# EAGLE design MK II (EAGLE 6.2)

## Sheet 1 of 3: Power Supply Regulated: +15, -15, +5
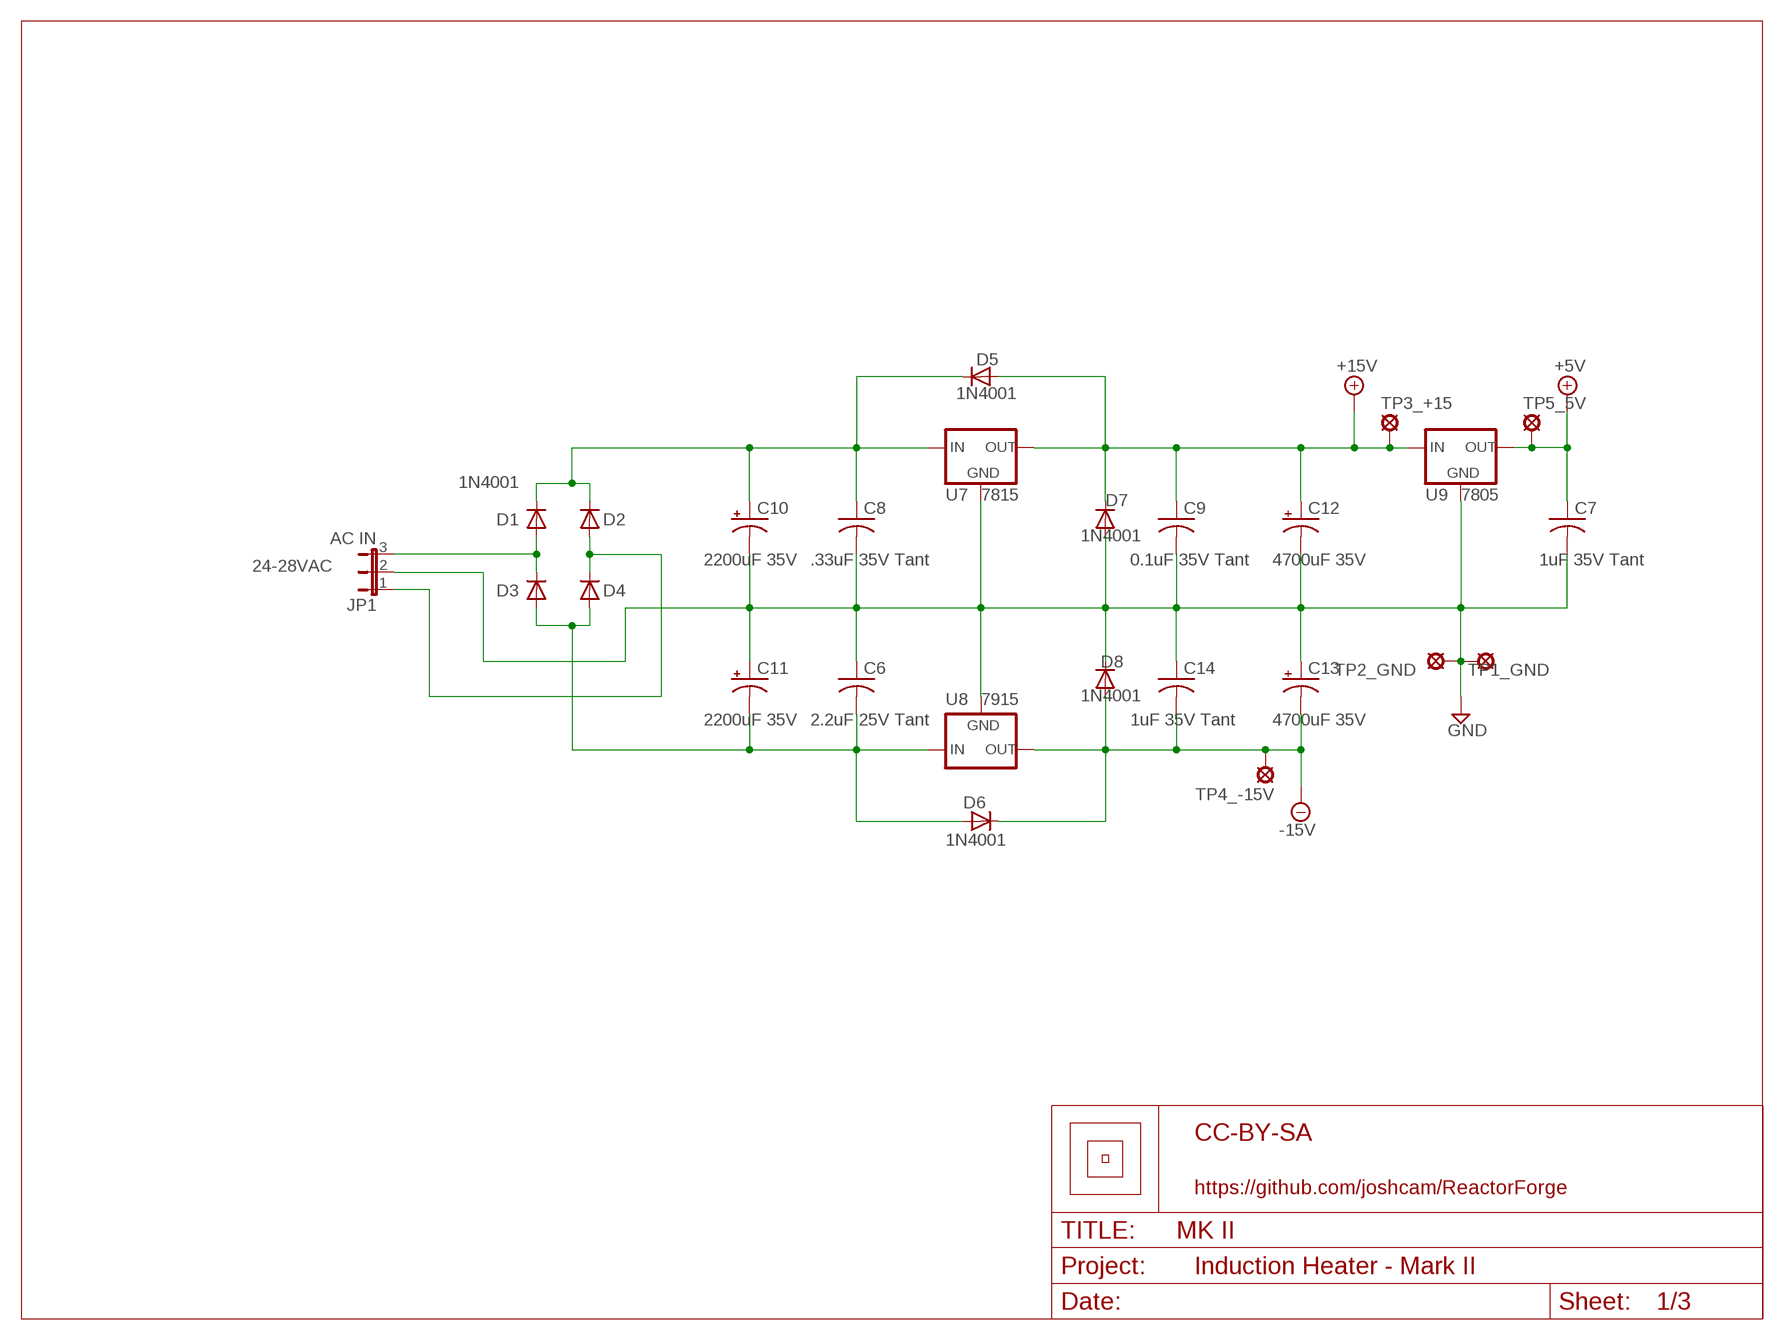
[diagram p0: schematic, sheet 1]
U$2 (LETTER_L): LICENSE: CC-BY-SA; PROJECT: Induction Heater - Mark II; URL: https://github.com/joshcam/ReactorForge

### Parts
C6  2.2uF 25V Tant  C-USC1206  [C1206]
C7  1uF 35V Tant  C-USC1206  [C1206]
C8  .33uF 35V Tant  C-USC1206  [C1206]
C9  0.1uF 35V Tant  C-USC1206  [C1206]
C10  2200uF 35V  CPOL-USE7.5-18  [E7,5-18]
C11  2200uF 35V  CPOL-USE7.5-18  [E7,5-18]
C12  4700uF 35V  CPOL-USE7.5-18  [E7,5-18]
C13  4700uF 35V  CPOL-USE7.5-18  [E7,5-18]
C14  1uF 35V Tant  C-USC1206  [C1206]
D1  1N4001  [DIODE.4-AXIAL]
D2  1N4001  [DIODE.4-AXIAL]
D3  1N4001  [DIODE.4-AXIAL]
D4  1N4001  [DIODE.4-AXIAL]
D5  1N4001  [DIODE.4-AXIAL]
D6  1N4001  [DIODE.4-AXIAL]
D7  1N4001  [DIODE.4-AXIAL]
D8  1N4001  [DIODE.4-AXIAL]
JP1  AC IN  JP2E  [JP2]
TP1_GND  SE14  [SE14]
TP2_GND  SE14  [SE14]
TP3_+15  SE14  [SE14]
TP4_-15V  SE14  [SE14]
TP5_5V  SE14  [SE14]
U7  7815  78XXS  [78XXS]
U8  7915  79XXS  [79XXS]
U9  7805  78XXS  [78XXS]

### Nets
+5V: C7.1 TP5_5V.MP U9.OUT ; also sheet 2
+15V: C9.1 C12.+ D5.A D7.C TP3_+15.MP U7.OUT U9.IN ; also sheet 2,3
-15V: C13.- C14.2 D6.C D8.A TP4_-15V.MP U8.OUT ; also sheet 2
GND: C6.1 C7.2 C8.2 C9.2 C10.- C11.+ C12.- C13.+ C14.1 D7.A D8.C JP1.2 TP1_GND.MP TP2_GND.MP U7.GND U8.GND U9.GND ; also sheet 2,3
N$10: C8.1 C10.+ D1.C D2.C D5.C U7.IN
N$12: D2.A D4.C JP1.1
N$16: D1.A D3.C JP1.3
N$17: C6.2 C11.- D3.A D4.A D6.A U8.IN

### Notes on the sheet
- 24-28VAC

## Sheet 2 of 3: Logic Control PLL/uController Resonant Lock Current Limiting System Monitoring
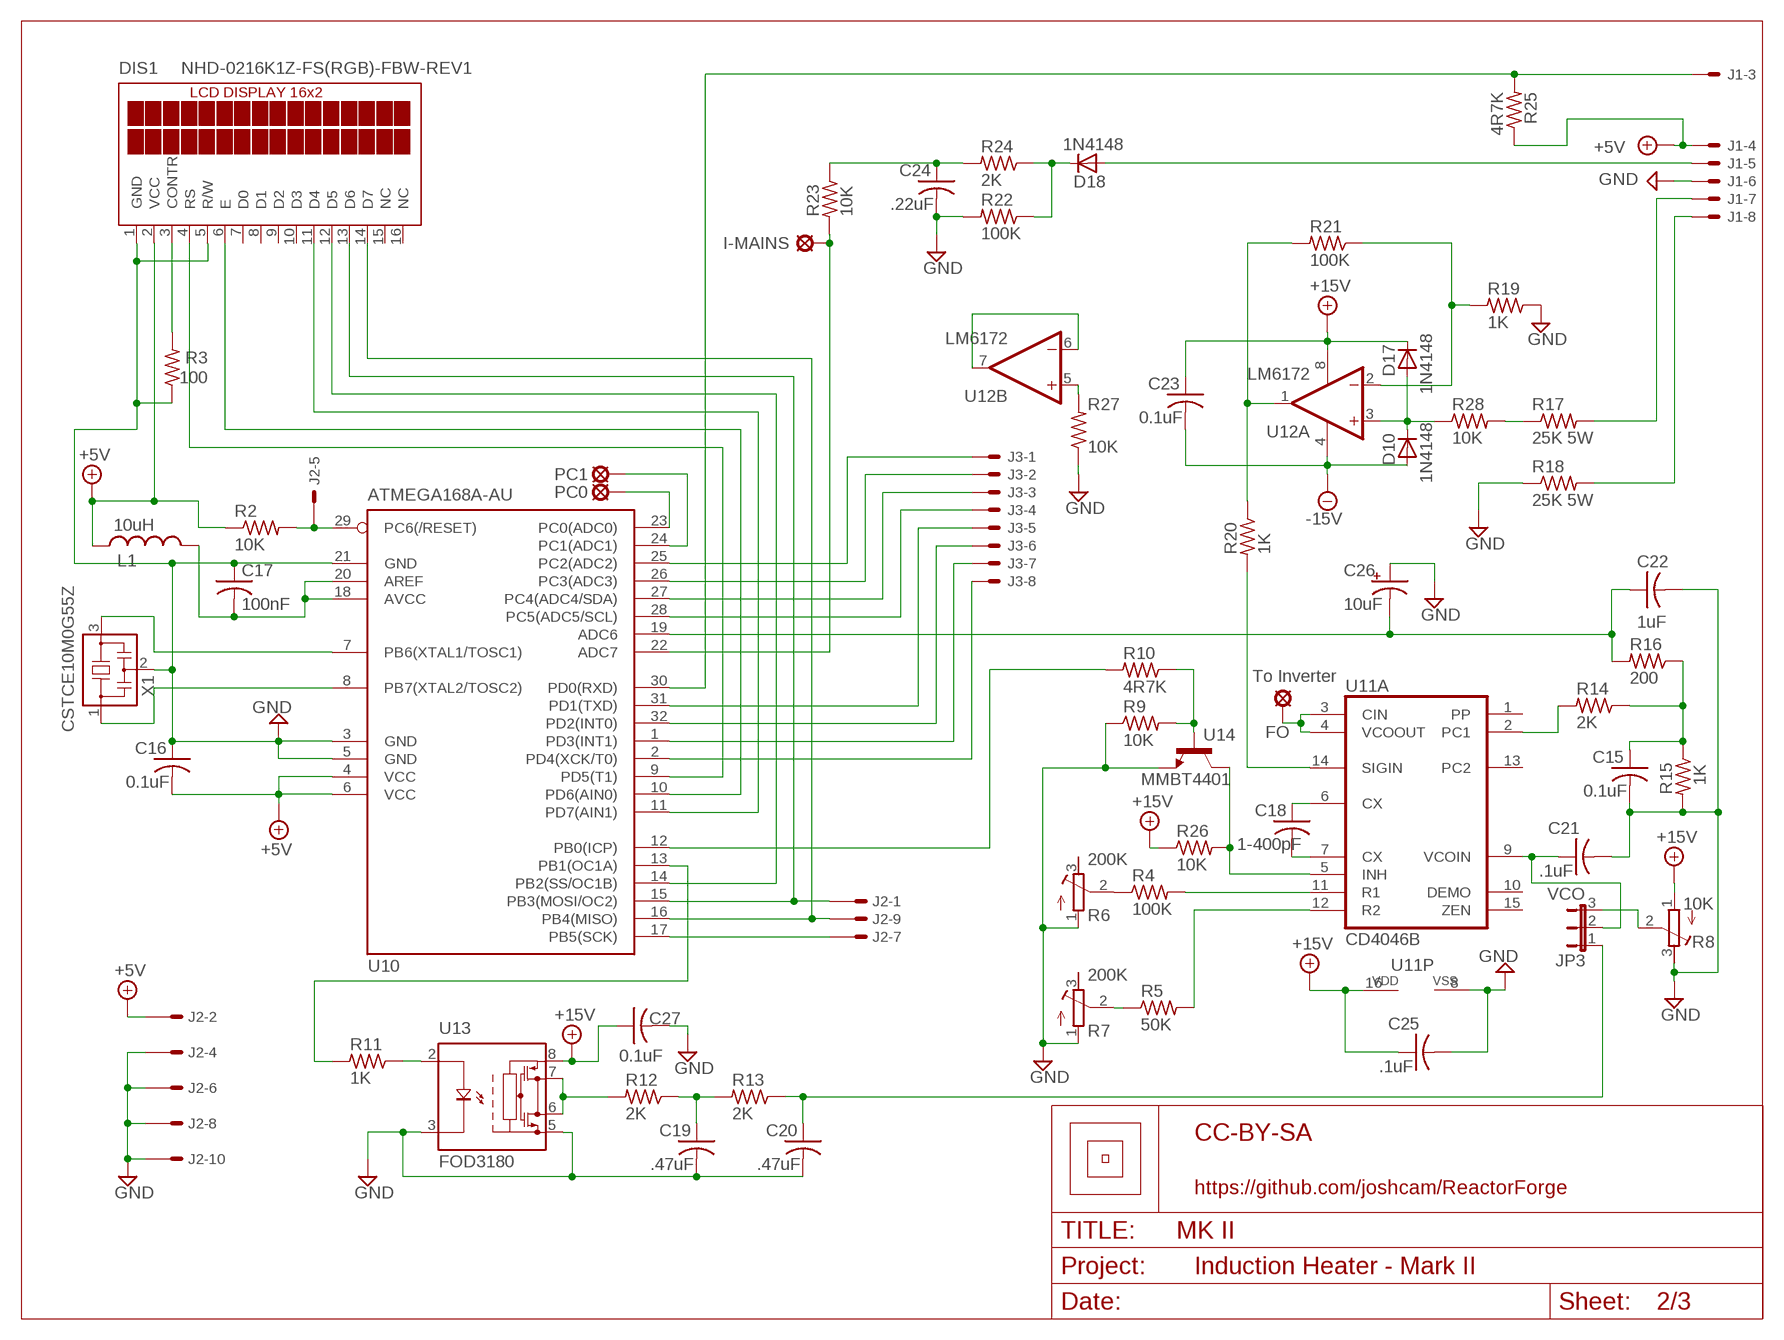
[diagram p1: schematic, sheet 2]
U$3 (LETTER_L): LICENSE: CC-BY-SA; PROJECT: Induction Heater - Mark II; URL: https://github.com/joshcam/ReactorForge

### Parts
C15  0.1uF  C-USC1206  [C1206]
C16  0.1uF  C-USC1206  [C1206]
C17  100nF  C-USC1206  [C1206]
C18  1-400pF  C-USC1206  [C1206]
C19  .47uF  C-USC1206  [C1206]
C20  .47uF  C-USC1206  [C1206]
C21  .1uF  C-USC1206  [C1206]
C22  1uF  C-USC1206  [C1206]
C23  0.1uF  C-USC1206  [C1206]
C24  .22uF  C-USC1206  [C1206]
C25  .1uF  C-USC1206  [C1206]
C26  10uF  CPOL-USE2.5-7  [E2,5-7]
C27  0.1uF  C-USC1206  [C1206]
D10  1N4148  [SOD-123]
D17  1N4148  [SOD-123]
D18  1N4148  [SOD-123]
DIS1  NHD-0216K1Z-FS(RGB)-FBW-REV1  TUXGR_16X2_R2  [TUXGR_16X2_R2]
FO  SE14  [SE14]
I-MAINS  SE14  [SE14]
J1  22-23-2081  [22-23-2081]
J2  057-010-1  [057-010-1]
J3  22-23-2081  [22-23-2081]
JP3  VCO  JP2E  [JP2]
L1  10uH  L-USL2012C  [L2012C]
PC0  SE14  [SE14]
PC1  SE14  [SE14]
R2  10K  R-US_M1206  [M1206]
R3  100  R-US_M1206  [M1206]
R4  100K  R-US_M1206  [M1206]
R5  50K  R-US_M1206  [M1206]
R6  200K  R-TRIMM4G/J  [RTRIM4G/J]
R7  200K  R-TRIMM4G/J  [RTRIM4G/J]
R8  10K  R-TRIMM4G/J  [RTRIM4G/J]
R9  10K  R-US_M1206  [M1206]
R10  4R7K  R-US_M1206  [M1206]
R11  1K  R-US_M1206  [M1206]
R12  2K  R-US_M1206  [M1206]
R13  2K  R-US_M1206  [M1206]
R14  2K  R-US_M1206  [M1206]
R15  1K  R-US_M1206  [M1206]
R16  200  R-US_M1206  [M1206]
R17  25K 5W  R-US_0617/22  [0617/22]
R18  25K 5W  R-US_0617/22  [0617/22]
R19  1K  R-US_M1206  [M1206]
R20  1K  R-US_M1206  [M1206]
R21  100K  R-US_M1206  [M1206]
R22  100K  R-US_M1206  [M1206]
R23  10K  R-US_M1206  [M1206]
R24  2K  R-US_M1206  [M1206]
R25  4R7K  R-US_M1206  [M1206]
R26  10K  R-US_M1206  [M1206]
R27  10K  R-US_M1206  [M1206]
R28  10K  R-US_M1206  [M1206]
U10  ATMEGA168A-AU  MEGA8-AI  [TQFP32-08]
U11  CD4046B  4046D  [SO16]
U12  LM6172  LM358D  [SO08]
U13  FOD3180  [SO08]
U14  MMBT4401  [SOT23]
X1  CSTCE10M0G55Z  [3-SMD]

### Nets
1WIRE: J1.3 R25.2 U10.30(PD0(RXD))
+5V: C16.2 DIS1.2(VCC) J1.4 J2.2 L1.1 R2.1 R25.1 U10.4(VCC) U10.6(VCC) ; also sheet 1
+15V: C23.1 C25.1 C27.1 D17.C R8.1(E) R26.1 U11.16(P:VDD) U12.8(P:V+) U13.8 ; also sheet 1,3
-15V: C23.2 D10.A U12.4(P:V-) ; also sheet 1
AVCC: C17.2 L1.2 U10.18(AVCC) U10.20(AREF)
FO: FO.MP U11.3(A:CIN) U11.4(A:VCOOUT) ; also sheet 3
GND: C15.2 C16.1 C17.1 C19.2 C20.2 C21.2 C22.2 C24.2 C25.2 C26.+ C27.2 DIS1.1(GND) DIS1.5(R/W) J1.6 J2.4 J2.6 J2.8 J2.10 R3.1 R6.1(E) R7.1(E) R8.3(A) R9.1 R15.2 R18.1 R19.1 R22.2 R27.1 U10.3(GND) U10.5(GND) U10.21(GND) U11.8(P:VSS) U13.3 U13.5 U14.2(E) X1.2 ; also sheet 1,3
GND1: C22.1 C26.- R16.2 U10.19(ADC6)
N$6: D10.C D17.A R28.1 U12.3(A:+IN)
N$8: U12.6(B:-IN) U12.7(B:OUT)
N$18: D18.A J1.5
N$19: U10.8(PB7(XTAL2/TOSC2)) X1.1
N$20: U10.7(PB6(XTAL1/TOSC1)) X1.3
N$21: J2.5 R2.2 U10.29(PC6(/RESET))
N$22: DIS1.3(CONTR) R3.2
N$23: R11.1 U13.2
N$24: DIS1.4(RS) U10.9(PD5(T1))
N$25: DIS1.6(E) U10.10(PD6(AIN0))
N$26: DIS1.11(D4) U10.11(PD7(AIN1))
N$27: DIS1.12(D5) U10.14(PB2(SS/OC1B))
N$28: DIS1.13(D6) J2.1 U10.15(PB3(MOSI/OC2))
N$29: DIS1.14(D7) J2.9 U10.16(PB4(MISO))
N$30: C18.1 U11.6(A:CX)
N$31: C18.2 U11.7(A:CX)
N$32: R4.1 R6.2(S)
N$33: R5.1 R7.2(S)
N$34: R4.2 U11.11(A:R1)
N$35: R5.2 U11.12(A:R2)
N$36: JP3.3 R8.2(S)
N$37: R19.2 R21.1 U12.2(A:-IN)
N$38: R26.2 U11.5(A:INH) U14.3(C)
N$39: R10.2 U10.12(PB0(ICP))
N$40: R11.2 U10.13(PB1(OC1A))
N$41: R9.2 R10.1 U14.1(B)
N$42: R14.2 U11.2(A:PC1)
N$43: R12.2 U13.6 U13.7
N$44: C15.1 R14.1 R15.1 R16.1
N$45: C19.1 R12.1 R13.2
N$46: C20.1 JP3.1 R13.1
N$47: C21.1 JP3.2 U11.9(A:VCOIN)
N$48: R27.2 U12.5(B:+IN)
N$49: R20.1 R21.2 U12.1(A:OUT)
N$50: R20.2 U11.14(A:SIGIN)
N$51: R17.1 R28.2
N$52: J1.8 R18.2
N$53: C24.1 R23.1 R24.2
N$54: D18.C R22.1 R24.1
N$55: I-MAINS.MP R23.2 U10.22(ADC7)
N$56: J1.7 R17.2
N$59: J2.7 U10.17(PB5(SCK))
N$60: J3.8 U10.2(PD4(XCK/T0))
N$61: J3.7 U10.1(PD3(INT1))
N$62: J3.6 U10.32(PD2(INT0))
N$63: J3.5 U10.31(PD1(TXD))
N$64: J3.4 U10.28(PC5(ADC5/SCL))
N$65: J3.3 U10.27(PC4(ADC4/SDA))
N$66: J3.2 U10.26(PC3(ADC3))
N$67: J3.1 U10.25(PC2(ADC2))
N$68: PC0.MP U10.23(PC0(ADC0))
N$69: PC1.MP U10.24(PC1(ADC1))
Unconnected: DIS1.7(D0) DIS1.8(D1) DIS1.9(D2) DIS1.10(D3) DIS1.15(NC) DIS1.16(NC) J2.3 R6.3(A) R7.3(A) U11.1(A:PP) U11.10(A:DEMO) U11.13(A:PC2) U11.15(A:ZEN)

### Notes on the sheet
- To Inverter

## Sheet 3 of 3: Inverter Driver 20W IGBT/MOSFET Driver +-15V Frequency Range: 50-500KHz
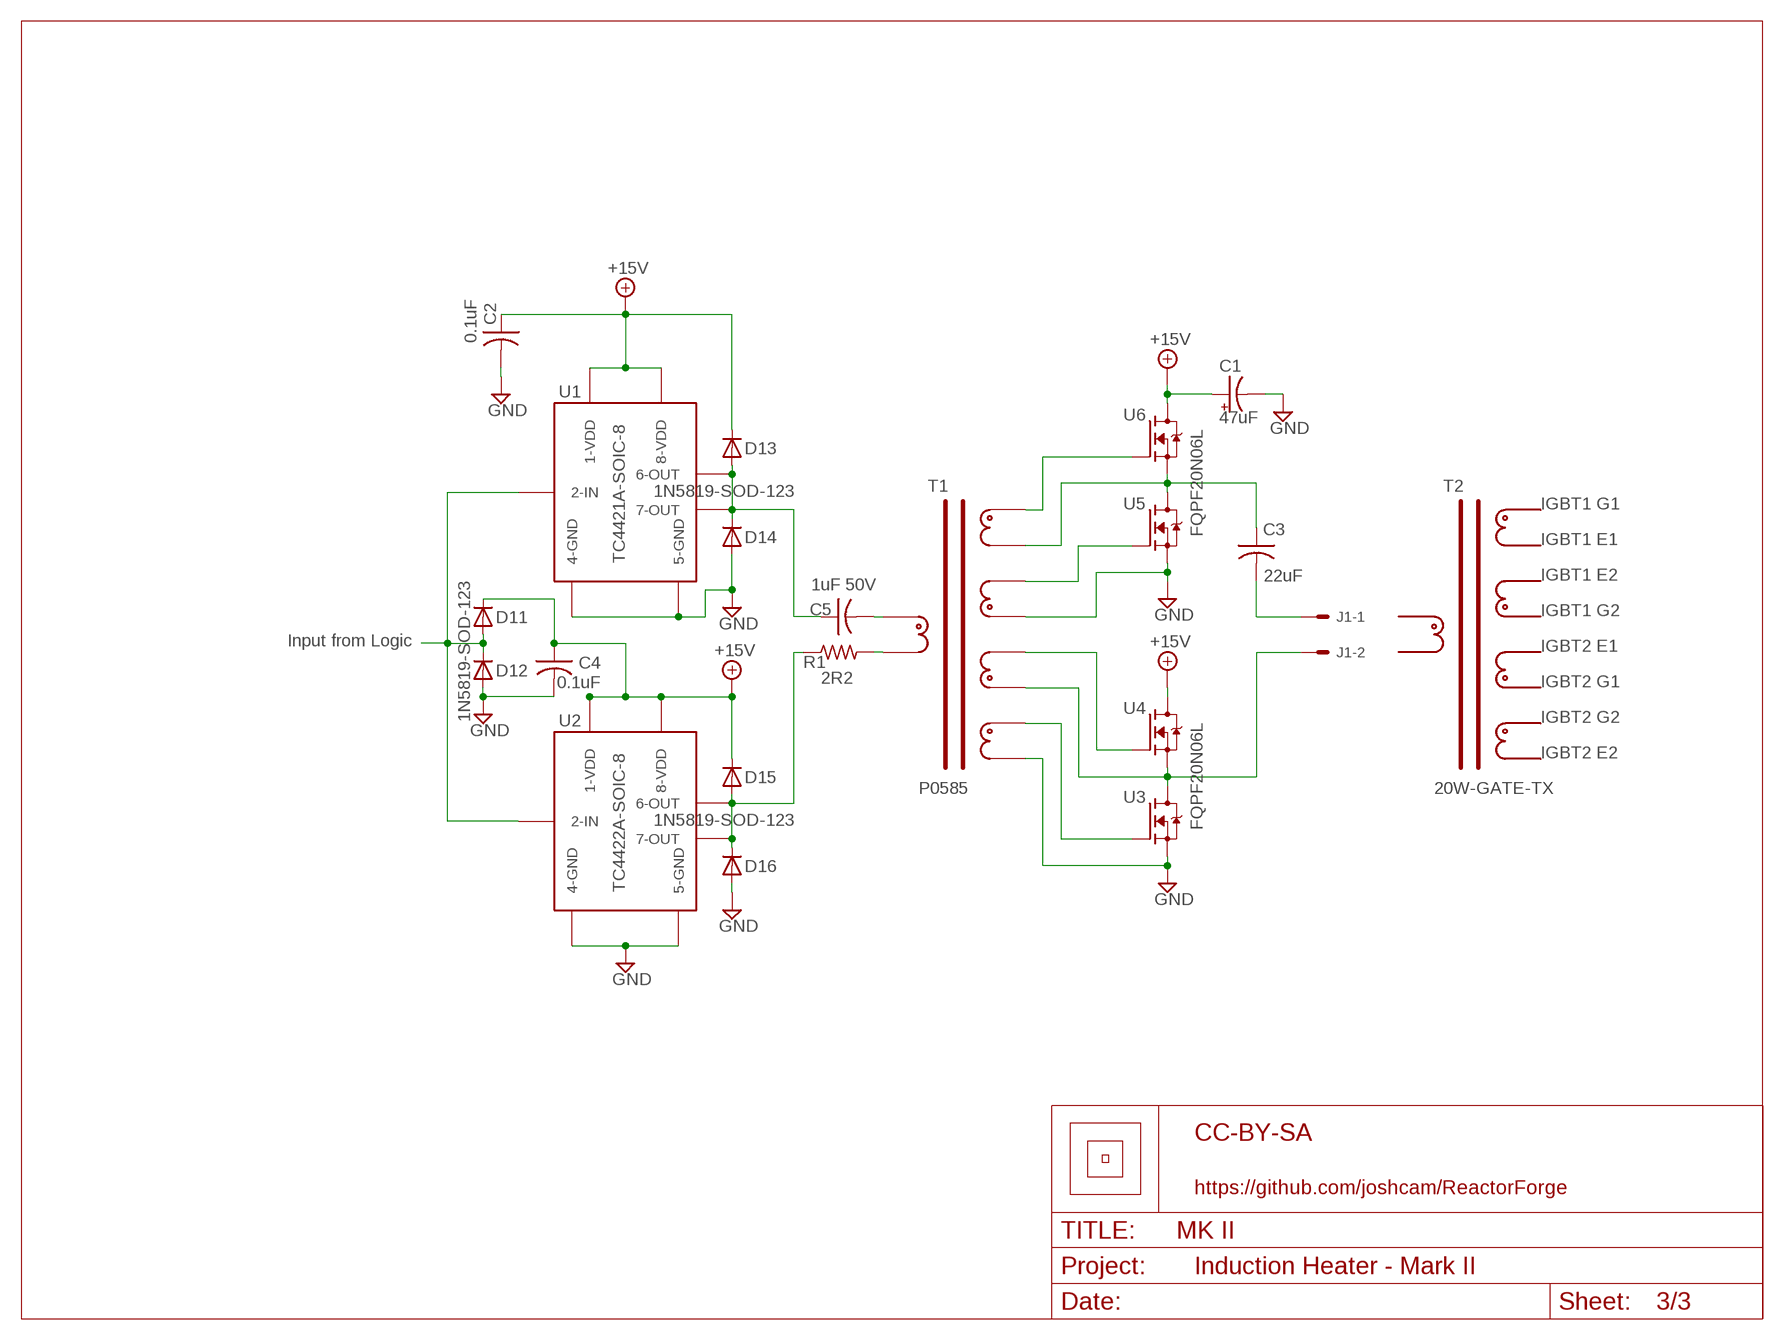
[diagram p2: schematic, sheet 3]
U$1 (LETTER_L): LICENSE: CC-BY-SA; PROJECT: Induction Heater - Mark II; URL: https://github.com/joshcam/ReactorForge

### Parts
C1  47uF  CPOL-USE2.5-7  [E2,5-7]
C2  0.1uF  C-USC1206  [C1206]
C3  22uF  C-USC1206  [C1206]
C4  0.1uF  C-USC1206  [C1206]
C5  1uF 50V  C-USC1206  [C1206]
D11  1N5819-SOD-123  [SOD-123]
D12  1N5819-SOD-123  [SOD-123]
D13  1N5819-SOD-123  [SOD-123]
D14  1N5819-SOD-123  [SOD-123]
D15  1N5819-SOD-123  [SOD-123]
D16  1N5819-SOD-123  [SOD-123]
R1  2R2  R-US_0207/10  [0207/10]
T1  P0585  [P0585]
U1  TC4421A-SOIC-8  [SOIC-8]
U2  TC4422A-SOIC-8  [SOIC-8]
U3  FQPF20N06L  [TO-220-V]
U4  FQPF20N06L  [TO-220-V]
U5  FQPF20N06L  [TO-220-V]
U6  FQPF20N06L  [TO-220-V]

### Nets
+15V: C1.+ C2.1 C4.1 D11.C D13.C D15.C U1.P$1(1-VDD) U1.P$8(8-VDD) U2.P$1(1-VDD) U2.P$8(8-VDD) U4.2(D) U6.2(D) ; also sheet 1,2
FO: D11.A D12.C U1.P$2(2-IN) U2.P$2(2-IN) ; also sheet 2
GND: C1.- C2.2 C4.2 D12.A D14.A D16.A T1.P$4 T1.P$6 U1.P$4(4-GND) U1.P$5(5-GND) U2.P$4(4-GND) U2.P$5(5-GND) U3.3(S) U5.3(S) ; also sheet 1,2
N$1: J1.2 T1.P$9 U3.2(D) U4.3(S)
N$2: C5.1 D13.A D14.C U1.P$6(6-OUT) U1.P$7(7-OUT)
N$3: C5.2 T1.P$1
N$4: R1.2 T1.P$10
N$5: D15.A D16.C R1.1 U2.P$6(6-OUT) U2.P$7(7-OUT)
N$7: C3.1 T1.P$3 U5.2(D) U6.3(S)
N$9: T1.P$2 U6.1(G)
N$11: T1.P$5 U5.1(G)
N$13: T1.P$8 U4.1(G)
N$14: T1.P$7 U3.1(G)
N$15: C3.2 J1.1

### Notes on the sheet
- IGBT1 G1
- IGBT1 E1
- IGBT1 E2
- IGBT1 G2
- Input from Logic
- IGBT2 E1
- IGBT2 G1
- IGBT2 G2
- IGBT2 E2

## Library data of the parts
C1 C10-C13 C26 = resistor:CPOL-US: POLARIZED CAPACITOR, American symbol
C2-C9 C14-C25 C27 = resistor:C-US: CAPACITOR, American symbol
D1-D8 = 1-Custom:1N4001: 1N4001 General Purpose Rectifier Diode
D10 D17 D18 = 1-Custom:1N4148: 1N4148
D11-D16 = 1-Custom:1N5819: 1N5819 Schottky Diode - 40V 1A
DIS1 = display-lcd:TUXGR_16X2_R2: Tuxgraphics LCD display 16x2 characters reflective, without background light Source: tuxgr_12x2_r2.pdf; OC_FARNELL: unknown; OC_NEWARK: unknown
FO I-MAINS PC0 PC1 TP1_GND TP2_GND TP3_+15 TP4_-15V TP5_5V = solpad:SE14: SOLDER PAD E1553, drill 1,4mm, distributor Buerklin, 07F820
J1 J3 = con-molex:22-23-2081: .100" (2.54mm) Center Header - 8 Pin; MF: MOLEX; MPN: 22-23-2081; OC_FARNELL: 1756826; OC_NEWARK: 01C7592
J2 = con-panduit:057-010-: CONNECTOR 10-pin series 057 contact pc board low profile headers; OC_FARNELL: unknown; OC_NEWARK: unknown
JP1 JP3 = jumper:JP2E: JUMPER
L1 = resistor:L-US: INDUCTOR, American symbol
R1 = rcl:R-US_: RESISTOR, American symbol
R2-R5 R9-R28 = resistor:R-US_: RESISTOR, American symbol
R6-R8 = resistor:R-TRIMM: Trimm resistor
T1 = 1-Custom:P0585: P0585NL 1:1:1:1 Offline Gate Drive Transformer 50-500KHz
U1 = 1-Custom:TC4421A: TC4421A 9A High-Speed MOSFET Driver
U2 = 1-Custom:TC4422A: TC4422A 9A High-Speed MOSFET Driver - Non-Inverting
U3-U6 = 1-Custom:FQPF20N06L: FQPF20N06L 60V LOGIC N-Channel MOSFET 30W Max
U7 U9 = v-reg:78XXS: VOLTAGE REGULATOR
U8 = v-reg:79XXS: VOLTAGE REGULATOR
U10 = atmel:MEGA8: MICROCONTROLLER 8 Kbytes FLASH, 1 kbytes SRAM, 512 bytes EEPROM, USART, 6-channel 10 bit ADC, 2-channel 8 bit ADC Pin compatible with Atmega48, ATMega88, ATMega168 Source: avr.lbr; MPN: ATMEGA8-16AU; OC_FARNELL: 9171371; OC_NEWARK: 73M8863
U11 = 40xx:4046: Micropower PLL
U12 = linear:LM358: OP AMP also LM158; LM258; LM2904 Source: http://cache.national.com/ds/LM/LM158.pdf
U13 = 1-Custom:FOD3180: FOD3180 2A High Speed Optocoupler
U14 = 1-Custom:MMBT4401: MMBT4401 40V NPN Small Signal Transistor
X1 = 1-Custom:CSTCE10M0G55Z: CSTCE10M0G55Z-R0 10MHz Ceramic Resonator Industrial Rated

## Net classes
1 supply: width 1.27 mm

## Board
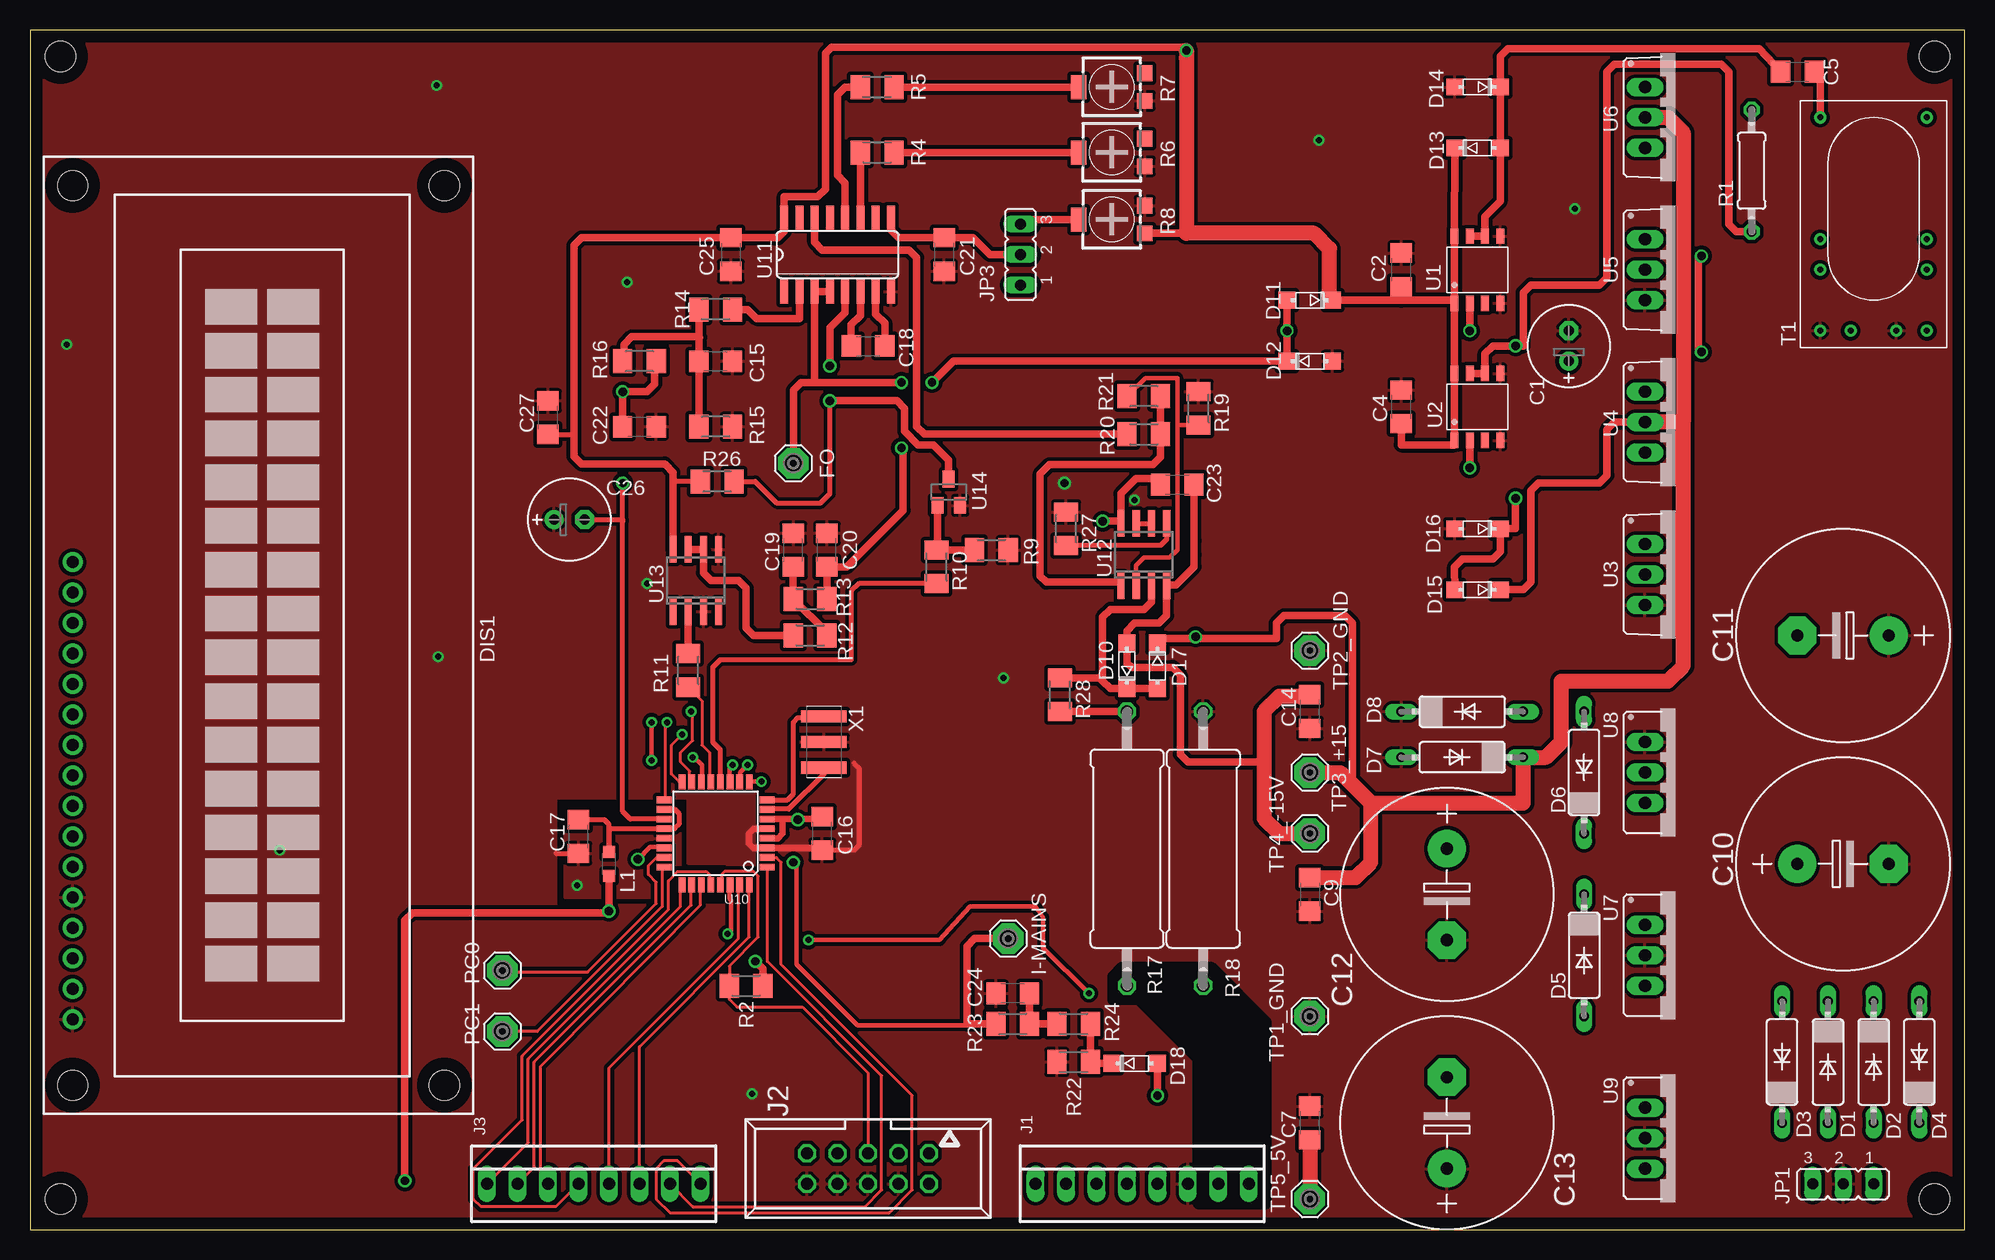
[diagram p3: board, top side]
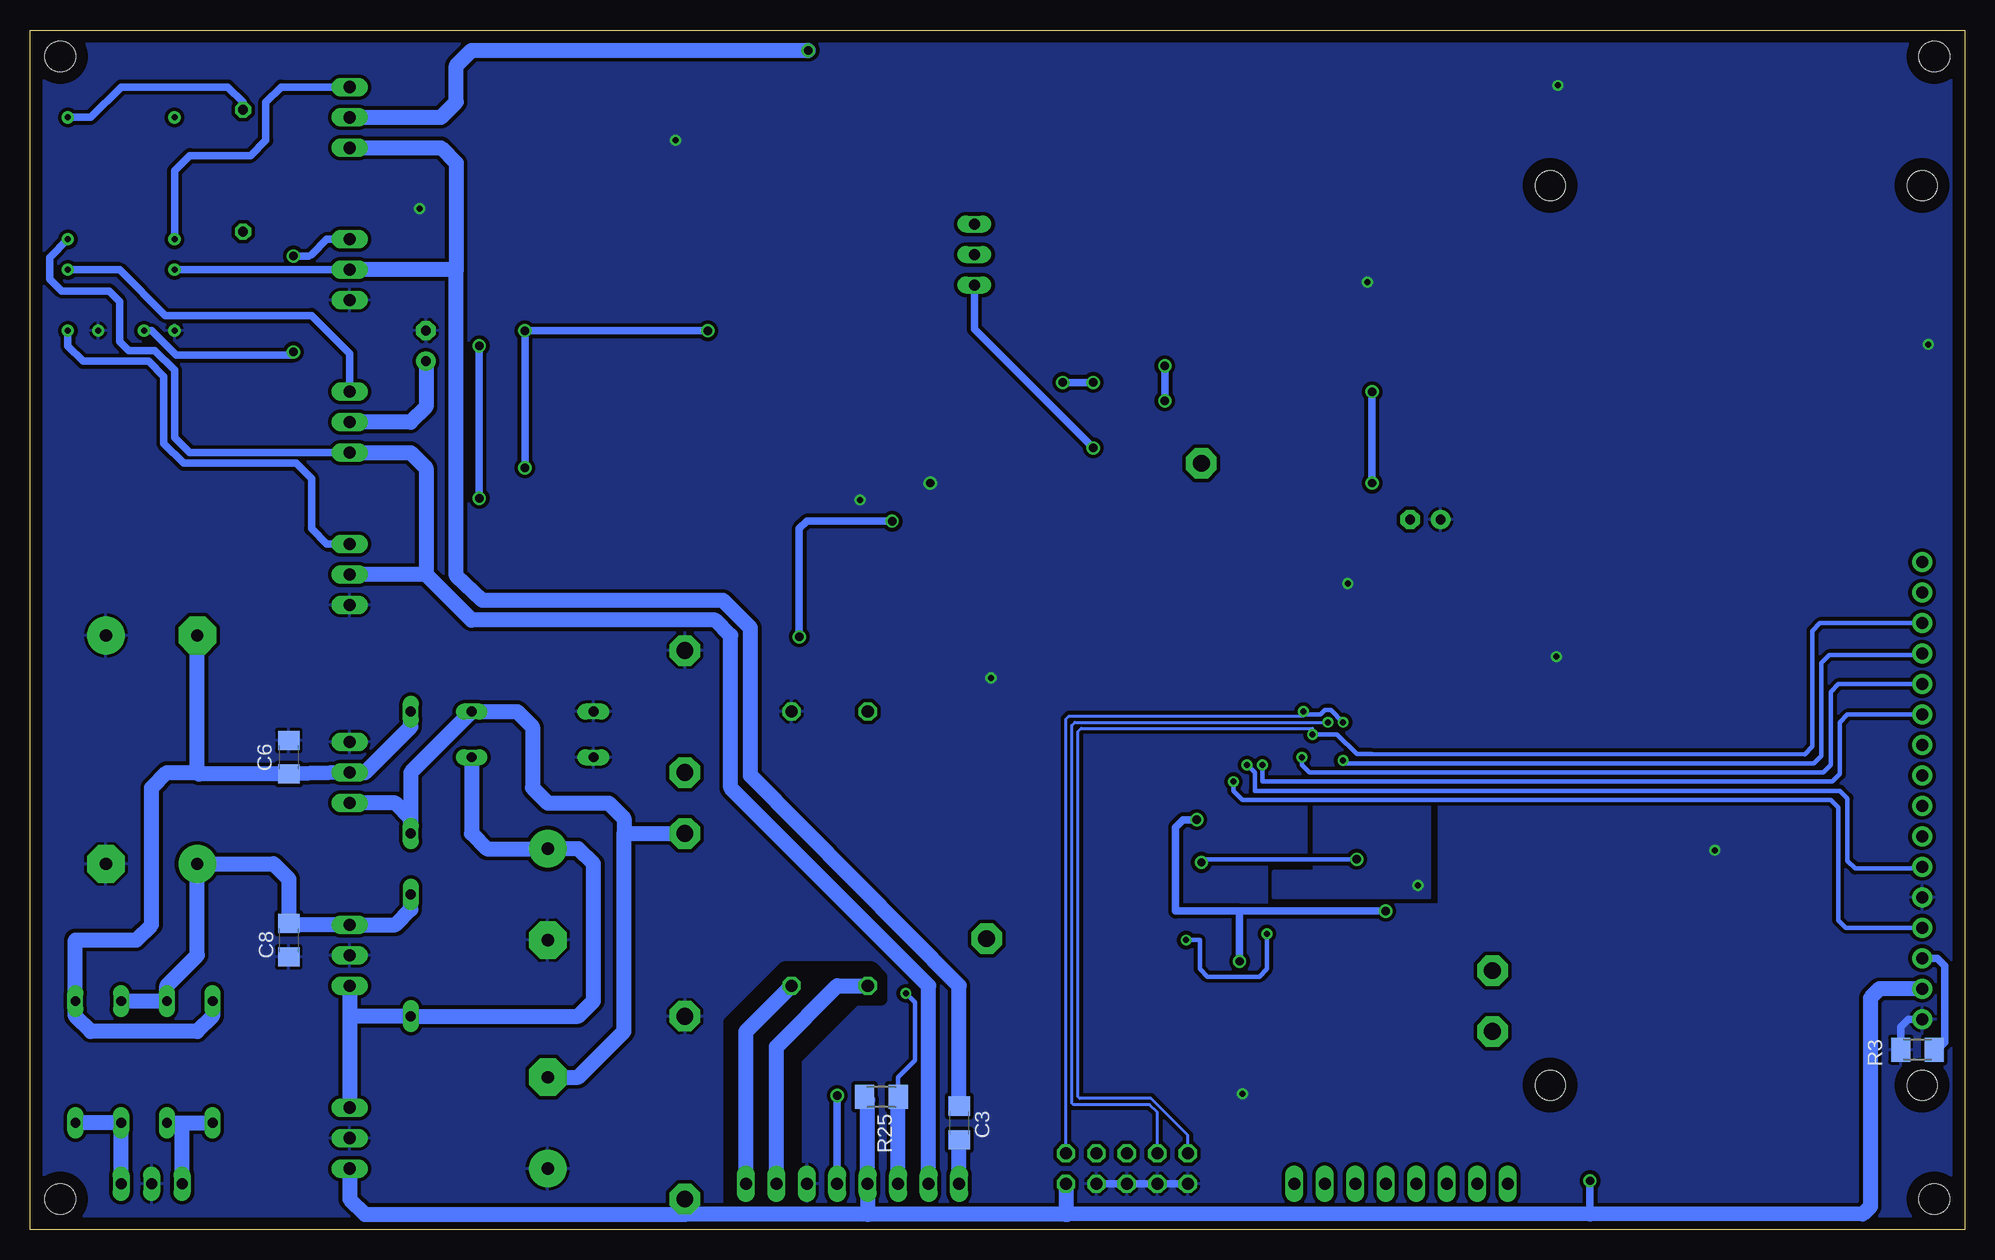
[diagram p4: board, bottom side, seen from below]

Size 161.27 x 100 mm. Coordinates in mm from the lower left corner, seen from the top.
Outline: 0,0 161.27,0 161.27,100 0,100 0,0
Copper layers (1*16): Top 0.035mm / dielectric 1.5mm / Bottom 0.035mm
Design rules: minimum track width 25mil, minimum drill 24mil, track to track 10mil, track to pad 10mil, pad to pad 10mil, via to via 10mil, smd to smd 10mil, copper to edge 40mil, drill to drill 8mil, minimum pad ring 10mil, minimum via ring 8mil, stop-mask expansion 4mil, vias tented up to drill 0mil, thermal gap 10mil
Holes 2.54 mm at 158.75,97.79 158.75,2.54 2.54,2.54 2.54,97.79
tRestrict: area 90.3,2.2 to 103,21.8
bRestrict: area 90.3,2.2 to 103,21.8

### Footprints (pad centres in the part's own frame; a part is rotated, then mirrored left to right if it is on the bottom)
E2,5-7 = drill 0.813 pad 1.6: + -1.27,0 | drill 0.813 pad 1.6 octagon: - 1.27,0
C1206 = smd 1.6 x 1.8: 1 -1.4,0; 2 1.4,0
E7,5-18 = drill 1.016 pad 3.15: + -3.81,0 | drill 1.016 pad 3.15 octagon: - 3.81,0
DIODE.4-AXIAL = drill 0.813 long: A 5.08,0; C -5.08,0
SOD-123 = smd 1.4 x 1.4: A 3.17,0; C -0.63,0
TUXGR_16X2_R2 = drill 1 pad 1.676: 1 -32,15.5; 2 -29.46,15.5; 3 -26.92,15.5; 4 -24.38,15.5; 5 -21.84,15.5; 6 -19.3,15.5; 7 -16.76,15.5; 8 -14.22,15.5; 9 -11.68,15.5; 10 -9.14,15.5; 11 -6.6,15.5; 12 -4.06,15.5; 13 -1.52,15.5; 14 1.02,15.5; 15 3.56,15.5; 16 6.1,15.5 | hole 2.5: -37.5,-15.5; 37.5,-15.5; -37.5,15.5; 37.5,15.5
SE14 = drill 1.397 pad 2.54 octagon: MP 0,0
22-23-2081 = drill 1 long: 1 -8.89,0; 2 -6.35,0; 3 -3.81,0; 4 -1.27,0; 5 1.27,0; 6 3.81,0; 7 6.35,0; 8 8.89,0
057-010-1 = drill 1 octagon: 1 -5.08,-1.27; 2 -5.08,1.27; 3 -2.54,-1.27; 4 -2.54,1.27; 5 0,-1.27; 6 0,1.27; 7 2.54,-1.27; 8 2.54,1.27; 9 5.08,-1.27; 10 5.08,1.27
JP2 = drill 0.914 long: 1 -2.54,0; 2 0,0; 3 2.54,0
L2012C = smd 1 x 1: 1 -1,0; 2 1,0
0207/10 = drill 0.813 octagon: 1 -5.08,0; 2 5.08,0
M1206 = smd 1.6 x 2: 1 -1.4,0; 2 1.4,0
RTRIM4G/J = smd 1.3 x 1.3: 1 -1.15,-2.75; 3 1.15,-2.75 | smd 2 x 1.3: 2 0,2.75
0617/22 = drill 1.016 octagon: 1 -11.43,0; 2 11.43,0
P0585 = drill 0.5 pad 1.016: P$1 -8.89,-4.445; P$2 1.27,-4.445; P$3 3.81,-4.445; P$4 8.89,-4.445; P$5 8.89,-1.905; P$6 8.89,1.905; P$7 8.89,4.445; P$8 3.81,4.445; P$9 1.27,4.445; P$10 -8.89,4.445
SOIC-8 = smd 0.66 x 1.27: P$1 -1.905,-2.794; P$2 -0.635,-2.794; P$3 0.635,-2.794; P$4 1.905,-2.794; P$5 1.905,2.794; P$6 0.635,2.794; P$7 -0.635,2.794; P$8 -1.905,2.794
TO-220-V = drill 1.016 long: 1 -2.54,0; 2 0,0; 3 2.54,0
78XXS = drill 1.016 long: GND 0,-2.54; IN -2.54,-2.54; OUT 2.54,-2.54
79XXS = drill 1.016 long: GND -2.54,-2.54; IN 0,-2.54; OUT 2.54,-2.54
TQFP32-08 = smd 1.27 x 0.559: 1 -4.293,2.8; 2 -4.293,2; 3 -4.293,1.2; 4 -4.293,0.4; 5 -4.293,-0.4; 6 -4.293,-1.2; 7 -4.293,-2; 8 -4.293,-2.8; 17 4.293,-2.8; 18 4.293,-2; 19 4.293,-1.2; 20 4.293,-0.4; 21 4.293,0.4; 22 4.293,1.2; 23 4.293,2; 24 4.293,2.8 | smd 0.559 x 1.27: 9 -2.8,-4.293; 10 -2,-4.293; 11 -1.2,-4.293; 12 -0.4,-4.293; 13 0.4,-4.293; 14 1.2,-4.293; 15 2,-4.293; 16 2.8,-4.293; 25 2.8,4.293; 26 2,4.293; 27 1.2,4.293; 28 0.4,4.293; 29 -0.4,4.293; 30 -1.2,4.293; 31 -2,4.293; 32 -2.8,4.293
SO16 = smd 0.66 x 2.032: 1 -4.445,-3.073; 2 -3.175,-3.073; 3 -1.905,-3.073; 4 -0.635,-3.073; 5 0.635,-3.073; 6 1.905,-3.073; 7 3.175,-3.073; 8 4.445,-3.073; 9 4.445,3.073; 10 3.175,3.073; 11 1.905,3.073; 12 0.635,3.073; 13 -0.635,3.073; 14 -1.905,3.073; 15 -3.175,3.073; 16 -4.445,3.073
SO08 = smd 0.6 x 2.2: 1 -1.905,-2.6; 2 -0.635,-2.6; 3 0.635,-2.6; 4 1.905,-2.6; 5 1.905,2.6; 6 0.635,2.6; 7 -0.635,2.6; 8 -1.905,2.6
SOT23 = smd 1 x 1.4: 1 -0.95,-1.1; 2 0.95,-1.1; 3 0,1.1
3-SMD = smd 1.016 x 3.81: 1 -2.135,0; 2 0,0; 3 2.135,0

### Placement (x,y rotation side)
C1  128.27,73.66 90 top
C2  114.3,80.01 90 top
C3  83.82,8.89 270 bottom
C4  114.3,68.58 90 top
C5  147.32,96.52 0 top
C6  139.7,39.37 270 bottom
C7  106.68,8.89 90 top
C8  139.7,24.13 270 bottom
C9  106.68,27.94 270 top
C10  151.13,30.48 0 top
C11  151.13,49.53 180 top
C12  118.11,27.94 270 top
C13  118.11,8.89 90 top
C14  106.68,43.18 90 top
C15  57.15,72.39 0 top
C16  66.04,33.02 90 top
C17  45.72,32.77 90 top
C18  69.85,73.66 0 top
C19  63.63,56.64 90 top
C20  66.42,56.64 90 top
C21  76.2,81.28 270 top
C22  50.8,66.93 0 top
C23  95.63,62.1 0 top
C24  81.92,19.68 180 top
C25  58.42,81.28 270 top
C26  44.96,59.18 0 top
C27  43.18,67.69 90 top
D1  149.86,13.97 270 top
D2  153.67,13.97 270 top
D3  146.05,13.97 90 top
D4  157.48,13.97 90 top
D5  129.54,22.86 270 top
D6  129.54,38.1 90 top
D7  119.38,39.37 180 top
D8  119.38,43.18 0 top
D10  91.44,45.72 90 top
D11  107.95,77.47 180 top
D12  105.41,72.39 0 top
D13  119.38,90.17 0 top
D14  121.92,95.25 180 top
D15  121.92,53.34 180 top
D16  121.92,58.42 180 top
D17  93.98,48.26 270 top
D18  90.81,13.84 0 top
DIS1  19.05,49.53 90 top
FO  63.63,63.88 0 top
I-MAINS  81.53,24.26 0 top
J1  92.71,3.81 0 top
J2  69.85,5.08 180 top
J3  46.99,3.81 0 top
JP1  151.13,3.81 180 top
JP3  82.55,81.28 90 top
L1  48.26,30.48 90 top
PC0  39.37,21.59 0 top
PC1  39.37,16.51 0 top
R1  143.51,88.27 90 top
R2  59.69,20.32 180 top
R3  3.94,14.99 0 bottom
R4  70.61,89.79 180 top
R5  70.61,95.25 180 top
R6  90.17,89.79 90 top
R7  90.17,95.25 90 top
R8  90.17,84.2 90 top
R9  80.14,56.64 180 top
R10  75.56,55.24 270 top
R11  54.86,46.61 270 top
R12  65.02,49.53 180 top
R13  65.02,52.58 180 top
R14  57.15,76.71 0 top
R15  57.15,66.93 0 top
R16  50.8,72.39 0 top
R17  91.44,31.75 270 top
R18  97.79,31.75 270 top
R19  97.41,68.45 270 top
R20  92.84,66.29 180 top
R21  92.84,69.47 0 top
R22  87,13.97 180 top
R23  81.92,17.14 180 top
R24  87,17.14 180 top
R25  90.3,11.05 0 bottom
R26  57.28,62.36 0 top
R27  86.36,58.42 270 top
R28  85.85,44.58 270 top
T1  153.67,83.82 270 top
TP1_GND  106.68,17.78 0 top
TP2_GND  106.68,48.26 0 top
TP3_+15  106.68,38.1 0 top
TP4_-15V  106.68,33.02 0 top
TP5_5V  106.68,2.54 0 top
U1  120.65,80.01 0 top
U2  120.65,68.58 0 top
U3  134.62,54.61 270 top
U4  134.62,67.31 270 top
U5  134.62,80.01 270 top
U6  134.62,92.71 270 top
U7  137.16,22.86 270 top
U8  137.16,38.1 270 top
U9  137.16,7.62 270 top
U10  57.15,33.02 180 top
U11  67.31,81.28 0 top
U12  92.84,56.26 0 top
U13  55.5,54.1 0 top
U14  76.58,61.47 0 top
X1  66.17,40.64 270 top

### Tracks (layer width: path | path; a pad name or v marks a point on that pad's centre or on a via)
1WIRE  (via drill 0.5 pad 0.61)
  Top 0.381: v88.27,19.68 84.45,23.5 84.45,26.04 83.82,26.92 78.36,26.92 75.82,24.13 v64.9,24.13 | v58.17,24.64 58.42,24.89 58.42,27.43 58.29,27.56 58.29,28.7 U10.30
  Bottom 0.381: v88.27,19.68 87.5,18.92 87.5,14.1 88.9,12.7 88.9,11.56 R25.2 | v64.9,24.13 63.75,24.13 63.75,21.72 63.12,21.08 58.8,21.08 58.17,21.72 v58.17,24.64
  Bottom 1.27: J1.3 88.9,4.06 R25.2
+5V  (via drill 0.7 pad 0.61)
  Top 0.406: 65.84,34.22 C16.2
  Top 0.559: U10.6 62.74,34.22 | 62.74,34.22 64.01,34.22 | 64.01,34.22 65.84,34.22 | U10.4 62.34,32.62 62.74,33.02 62.74,34.22 | v64.01,34.16 64.01,34.22
  Top 0.635: v31.24,4.06 31.24,25.78 31.88,26.42 48.26,26.42 v48.26,26.54 L1.1 | v60.45,22.35 61.09,21.72 R2.1
  Top 1.27: C7.1 TP5_5V.MP
  Bottom 0.635: v31.24,4.06 31.24,1.31 | 60.45,26.54 v48.26,26.54 | v60.45,22.35 60.45,26.54 | 60.45,26.54 65.79,26.54 65.79,33.53 65.15,34.16 v64.01,34.16
  Bottom 1.27: U9.OUT 134.62,2.54 133.35,1.27 106.68,1.27 | 106.68,1.27 TP5_5V.MP | 91.44,1.27 J1.4 91.44,10.79 R25.1 | 91.44,1.27 106.68,1.27 | J2.2 74.93,1.4 | 74.93,1.4 74.93,1.27 91.44,1.27 | DIS1.2 7.11,20.07 7.87,19.31 7.87,1.91 8.51,1.27 31.24,1.31 74.8,1.27 74.93,1.4
+15V  (via drill 0.7 pad 0.61)
  Top 0.406: C27.1 45.34,66.29 | R26.1 53.59,62.36 53.59,62.48
  Top 0.635: D13.C U1.P$8 118.75,77.47 | 118.75,77.47 U1.P$1 U2.P$8 U2.P$1 118.75,65.41 114.3,65.41 C4.1 | 118.75,77.47 114.3,77.47 | 114.3,77.47 C2.1 | 114.3,77.47 D11.C 108.33,77.72 | D15.C 124.46,53.34 125.09,53.98 125.09,61.59 125.73,62.23 130.81,62.23 131.44,62.87 131.44,66.67 132.08,67.31 U4.2 | D17.C 94.37,49.28 97.03,49.28 | 97.03,49.28 103.89,49.28 103.89,50.55 104.52,51.18 109.6,51.18 110.24,50.55 110.24,37.08 | v89.41,59.05 90.93,59.05 U12.8 90.93,61.34 92.2,62.61 93.85,62.61 93.85,62.1 C23.1 | v97.16,49.4 97.03,49.28 | R8.1 96.39,83.06 96.39,83.19 | 96.39,97.66 96.39,98.55 66.8,98.55 66.29,98.04 66.29,86.74 65.66,86.11 62.87,86.11 U11.16 62.87,83.19 62.36,82.68 C25.1 45.97,82.68 45.34,82.04 45.34,66.29 45.34,64.45 45.97,63.81 52.91,63.81 52.96,63.76 53.59,63.12 53.59,62.48 U13.8
  Top 1.27: 137.79,67.31 137.79,91.44 136.53,92.71 U6.2 | 137.79,67.31 U4.2 | 137.79,67.31 137.79,46.99 136.53,45.72 127.64,45.72 127.64,40.64 126.36,39.37 D7.C 124.46,35.56 111.76,35.56 | C9.1 110.49,29.34 111.76,30.61 111.76,35.56 | TP3_+15.MP 109.22,38.1 110.24,37.08 111.76,35.56 | 108.33,77.72 108.33,81.79 107.06,83.06 96.39,83.06 | v96.39,98.3 96.39,97.66 96.39,83.19
  Bottom 0.635: v89.41,59.05 96.52,59.05 97.16,58.42 v97.16,49.4
  Bottom 1.27: U7.OUT 134.62,17.78 | 134.62,17.78 U9.IN | 134.62,17.78 D5.A 115.57,17.78 114.3,19.05 114.3,30.48 115.57,31.75 C12.+ 123.19,31.75 124.46,33.02 D7.C | C1.+ 128.27,68.58 129.54,67.31 U4.2 | U6.2 127,92.71 125.73,93.98 125.73,97.03 124.46,98.3 v96.39,98.3
-15V
  Top 0.635: 102.87,38.99 96.52,38.99 95.89,39.62 95.89,46.23 95.25,46.86 91.9,46.86 91.44,47.17 D10.A 91.44,49.91 92.08,50.55 94.11,50.55 94.74,51.18 U12.4 94.8,53.72 95.5,53.72 97.03,55.24 97.03,56.26 97.03,57.4 C23.2
  Top 1.27: C14.2 106.55,44.45 104.14,44.45 102.87,43.18 102.87,38.99 102.87,34.29 104.14,33.02 TP4_-15V.MP
  Bottom 1.27: C13.- 115.57,12.7 111.76,16.51 111.76,33.02 | 111.76,33.02 TP4_-15V.MP | U8.OUT 130.81,35.56 129.54,34.29 D6.C 129.54,38.1 D8.A 120.65,43.18 119.38,41.91 119.38,36.83 118.11,35.56 113.03,35.56 111.76,34.29 111.76,33.02
AVCC
  Top 0.406: C17.2 47.88,34.17 48.26,33.78 L1.2 48.26,33.4 52.84,33.4 U10.20 53.74,33.42 54.1,33.78 54.1,34.67 53.72,35.05 52.89,35.05 U10.18
FO  (via drill 0.7 pad 0.61)
  Top 0.635: D11.A v104.78,74.93 | v104.78,74.93 D12.C 76.96,72.39 v75.18,70.61 | U1.P$2 v120.02,74.93 | U2.P$2 v120.02,63.5 | v104.78,74.93 | U11.4 U11.3 65.41,70.61 | 65.41,70.61 v72.64,70.61 | FO.MP 63.63,69.98 64.26,70.61 65.41,70.61
  Bottom 0.635: v120.02,63.5 v120.02,74.93 v104.78,74.93 | v72.64,70.61 v75.18,70.61
GND  (via drill 0.5 pad 0.61, 0.7)
  Top 0.406: 61.42,33.4 U10.5 | 65.84,31.82 C16.1 68.71,31.62 69.09,32 69.09,38.48 68.71,38.86 | 43.81,31.37 C17.1
  Top 0.559: 59.94,32.64 59.94,32.13 60.26,31.82 U10.3 65.84,31.82 | 59.94,32.64 59.94,33.02 60.33,33.4 61.42,33.4 | 59.92,32.62 59.94,32.64
  Top 0.635: U2.P$5 122.56,71.75 | R6.1 | R15.2 | 58.93,80.39 C25.2
  Top 1.27: C14.1 106.68,41.91
  Bottom 0.61: J2.10 J2.8 J2.6 J2.4
  Bottom 0.635: DIS1.1 4.7,17.53 5.34,16.89 R3.1
  Bottom 1.27: 134.75,40.77 U8.GND | 134.75,22.73 U7.GND
  other vias: 128.78,85.09 107.44,90.81 81.15,45.97 60.2,11.3 49.78,78.99 33.91,95.38 34.04,47.75 3.05,73.79 51.44,53.85 20.83,31.62 45.59,28.7 92.08,60.83 86.23,62.23
  pour Bottom (isolate 0.305): 57.66,29.84 57.66,27.69 44.58,27.69 44.58,35.31 54.23,35.31 54.23,29.84
  pour Top (isolate 0.305): 54.23,35.31 44.58,35.31 44.58,27.69 57.66,27.69 57.66,29.84 54.23,29.84
  pour Bottom (isolate 0.305): 161.16,0.13 0.13,0.13 0.13,35.81 43.81,35.81 43.81,27.05 58.17,27.05 58.17,30.48 54.86,30.48 54.86,35.94 0.13,35.94 0.13,99.82 161.16,99.82
  pour Top (isolate 0.305): 161.16,0.13 0.13,0.13 0.13,35.81 43.81,35.81 43.81,27.05 58.17,27.05 58.17,30.48 54.86,30.48 54.86,35.94 0.13,35.94 0.13,99.82 161.16,99.82
GND1  (via drill 0.7 pad 0.61)
  Top 0.406: U10.19 50.04,34.22 49.4,34.85 49.4,59.05 49.4,59.18 | 49.4,59.18 v49.4,62.23 | C26.- 49.4,59.18
  Top 0.635: R16.2 52.07,72.26 52.07,70.48 51.44,69.85 v49.4,69.85 C22.1 49.4,66.67
  Bottom 0.635: v49.4,62.23 v49.4,69.85
N$1
  Bottom 0.635: U4.3 147.96,64.77 149.22,66.04 149.22,71.63 150.88,73.28 153.03,73.28 153.8,74.04 153.8,77.34 154.69,78.23 158.62,78.23 159.64,79.25 159.64,81.03 T1.P$9
  Bottom 1.27: J1.2 86.36,20.32 102.87,36.83 102.87,49.53 104.14,50.8 124.46,50.8 128.27,54.61 | 128.27,54.61 U3.2 | U4.3 129.54,64.77 128.27,63.5 128.27,54.61
N$2
  Top 0.635: C5.1 144.15,98.42 123.19,98.42 122.55,97.79 D14.C D13.A 122.56,85.72 121.28,84.45 U1.P$6 U1.P$7
N$3
  Top 0.635: C5.2 149.22,95.89 T1.P$1
N$4
  Bottom 0.635: R1.2 143.51,93.98 144.78,95.25 153.67,95.25 156.21,92.71 T1.P$10
N$5  (via drill 0.7 pad 0.61)
  Top 0.635: D15.A 118.75,55.24 119.38,55.88 121.92,55.88 122.55,56.52 D16.C 123.83,58.42 v123.83,60.96 | U2.P$7 U2.P$6 121.28,73.03 121.92,73.66 v123.83,73.66 124.46,73.66 124.46,78.11 125.09,78.74 130.81,78.74 131.44,79.38 131.44,96.52 132.08,97.16 140.97,97.16 141.6,96.52 141.6,83.82 142.24,83.19 R1.1
  Bottom 0.635: v123.83,60.96 v123.83,73.66
N$6
  Top 0.635: D17.A D10.C 90.05,45.09 89.41,45.72 | U12.3 93.47,52.32 92.84,51.69 90.04,51.69 89.41,51.05 89.41,45.72 | R28.1 89.15,45.98 89.41,45.72
N$7
  Bottom 0.635: T1.P$3 U5.2
  Bottom 1.27: C3.1 83.82,20.32 101.22,37.85 101.22,50.16 103.5,52.45 123.57,52.45 125.73,54.48 125.73,80.01 | 125.73,80.01 U5.2 | U6.3 127,90.17 125.73,88.9 125.73,80.01
N$8
  Top 0.406: U12.7 U12.6
N$9
  Bottom 0.635: U6.1 140.34,95.25 141.6,93.98 141.6,90.81 142.88,89.53 147.96,89.53 149.22,88.27 T1.P$2
N$10
  Bottom 1.27: D2.C D1.C 149.86,20.32 147.32,22.86 C10.+ 140.97,30.48 139.7,29.21 C8.1 139.57,25.4 U7.IN 130.81,25.4 129.54,26.67 D5.C
N$11  (via drill 0.7)
  Top 0.635: v139.32,81.15 139.06,80.9 139.06,73.41 v139.32,73.15
  Bottom 0.635: U5.1 136.53,82.55 137.79,81.28 138.05,81.15 v139.32,81.15 | T1.P$5 151.13,74.93 149.1,72.9 139.32,72.9 v139.32,73.15
N$12
  Bottom 1.27: JP1.1 D2.A D4.C
N$13
  Bottom 0.635: U4.1 134.62,73.03 137.79,76.2 149.99,76.2 153.8,80.01 T1.P$8
N$14
  Bottom 0.635: U3.1 136.53,57.15 137.79,58.42 137.79,62.61 139.06,63.88 148.46,63.88 150.11,65.53 150.11,71.12 151.38,72.39 156.84,72.39 158.12,73.66 T1.P$7
N$15
  Bottom 1.27: J1.1 C3.2
N$16
  Bottom 1.27: JP1.3 148.59,8.89 | 148.59,8.89 D3.C | D1.A 148.59,8.89
N$17
  Bottom 1.27: 147.32,38.1 147.19,37.97 C6.2 U8.IN 133.35,38.1 129.54,41.91 D6.A | 147.32,38.1 C11.- | 147.32,38.1 149.86,38.1 151.13,36.83 151.13,25.4 152.4,24.13 157.48,24.13 D4.A 157.48,17.78 156.21,16.51 147.32,16.51 146.05,17.78 D3.A
N$18  (via drill 0.7 pad 0.61)
  Top 0.635: D18.A v93.98,11.18
  Bottom 0.635: J1.5 v93.98,11.18
N$19
  Top 0.406: U10.8 63.12,35.82 63.63,36.32 63.63,42.29 64.01,42.67 66.14,42.67 X1.1
N$20
  Top 0.406: X1.3 66.19,38 63.25,35.05 61.48,35.05 U10.7
N$21
  Top 0.254: U10.29 57.66,28.83 57.66,29.59 57.91,29.84 60.33,29.84 60.71,29.46 60.71,24.38 58.29,21.97 R2.2 58.29,19.81 58.29,19.18 58.93,18.54 64.39,18.54 69.85,13.08 J2.5
N$22
  Bottom 0.635: R3.2 2.29,14.99 1.65,15.62 1.65,21.97 2.29,22.61 DIS1.3
N$23
  Top 0.635: R11.1 U13.2
N$24  (via drill 0.5 pad 0.61)
  Top 0.381: v60.96,37.34 60.07,37.34 U10.9
  Bottom 0.381: DIS1.4 9.91,25.15 10.54,25.78 10.54,35.18 11.18,35.81 60.2,35.81 60.96,36.58 v60.96,37.34
N$25  (via drill 0.5 pad 0.61)
  Top 0.381: v59.82,38.73 59.18,38.1 59.18,37.34 U10.10
  Bottom 0.381: DIS1.6 3.68,30.1 9.14,30.1 9.78,30.73 9.78,35.94 10.41,36.58 59.18,36.58 59.18,38.1 v59.82,38.73
N$26  (via drill 0.5 pad 0.61)
  Top 0.381: v58.55,38.73 58.29,38.48 58.29,37.34 U10.11
  Bottom 0.381: DIS1.11 9.78,42.93 10.41,42.29 10.41,37.97 11.05,37.34 58.55,37.34 v58.55,38.73
N$27  (via drill 0.5 pad 0.61)
  Top 0.381: v55.24,39.37 55.37,39.37 56.01,38.73 56.01,37.21 U10.14
  Bottom 0.381: DIS1.12 10.54,45.47 11.18,44.83 11.18,38.73 11.81,38.1 54.61,38.1 55.24,38.73 v55.24,39.37
N$28  (via drill 0.5 pad 0.61)
  Top 0.254: v55.12,43.18 55.24,43.05 55.24,40.77 54.23,39.75 54.23,38.99 54.99,38.23 54.99,37.72 55.24,37.47 55.12,37.34 U10.15
  Top 0.381: v51.82,39.12 v51.82,42.29
  Bottom 0.254: J2.1 74.93,42.55 74.68,42.8 55.12,42.8 55.12,42.93
  Bottom 0.381: DIS1.13 3.68,47.88 11.3,47.88 11.94,47.24 11.94,39.5 12.57,38.86 51.56,38.86 v51.82,39.12 | v51.82,42.29 52.83,43.31 53.34,43.31 53.72,42.93 55.12,42.93 v55.12,43.18
N$29  (via drill 0.5 pad 0.61)
  Top 0.254: v54.36,41.27 53.47,40.39 53.47,37.97 54.1,37.34 54.36,37.34 U10.16
  Bottom 0.254: J2.9 64.77,7.87 67.82,10.92 73.79,10.92 73.91,11.05 73.91,41.53 73.66,41.78 54.36,41.78 v54.36,41.27
  Bottom 0.381: DIS1.14 12.06,50.55 12.7,49.91 12.7,40.26 13.34,39.62 49.4,39.63 50.67,39.63 52.32,41.28 52.32,41.27 v54.36,41.27
N$30
  Top 0.635: U11.6 69.22,76.2 69.21,76.2 68.45,75.44 C18.1
N$31
  Top 0.635: U11.7 70.48,76.33 70.49,76.33 71.25,75.56 C18.2
N$32
  Top 0.635: R6.2 R4.1
N$33
  Top 0.635: R5.1 R7.2
N$34
  Top 0.635: R4.2 U11.11
N$35
  Top 0.635: U11.12 67.94,87.25 67.31,87.88 67.31,94.61 67.94,95.25 R5.2
N$36
  Top 0.635: R8.2 82.93,84.2 JP3.3
N$37
  Top 0.381: R21.1 92.96,70.99 95.63,70.99 95.63,67.06 | 95.63,67.06 95.63,56.64 95,56.01 92.84,56.01 92.2,55.37 U12.2 | R19.2 95.63,67.06
  Top 0.635: R21.1 | R19.2
N$38  (via drill 0.7 pad 0.61)
  Top 0.406: R26.2 60.45,62.36 62.23,60.58 65.91,60.58 66.67,61.34 v66.67,69.09
  Top 0.635: v66.67,72.01 66.67,75.18 67.94,76.45 U11.5 | U14.3 76.58,64.14 75.31,65.41 74.04,65.41 72.9,66.55 72.9,68.45 72.26,69.09 v66.67,69.09
  Bottom 0.635: v66.67,72.01 v66.67,69.09
N$39
  Top 0.406: R10.2 69.09,53.84 68.45,53.21 68.45,47.5 57.53,47.5 56.9,46.86 56.9,40.64 57.53,40.01 57.53,37.33 U10.12
N$40
  Top 0.254: R11.2 54.84,45.21 | U10.13 56.64,37.42 56.64,39.75 56.01,40.39 56.01,44.07 R11.2
  Top 0.381: R11.2
N$41
  Top 0.635: U14.1 75.63,56.71 R10.1 R9.2
N$42
  Top 0.635: R14.2 59.82,76.71 60.58,75.95 64.14,75.95 U11.2
N$43
  Top 0.635: U13.7 U13.6 56.13,54.74 56.77,54.1 59.05,54.1 59.69,53.47 59.69,50.16 60.33,49.53 R12.2
N$44
  Top 0.635: R16.1 49.53,72.52 49.53,73.79 50.16,74.42 55.75,74.42 | 55.75,74.42 C15.1 R15.1 | 55.75,74.42 55.81,74.36 | 55.75,74.42 R14.1
N$45
  Top 0.635: R12.1 66.42,49.78 R13.2 C19.1
N$46  (via drill 0.7 pad 0.61)
  Top 0.635: R13.1 C20.1 66.67,55.24 68.07,55.24 72.77,59.94 72.77,64.9 v72.64,65.15
  Bottom 0.635: v72.64,65.15 82.55,75.06 JP3.1
N$47
  Top 0.635: JP3.2 80.01,81.28 78.61,82.68 C21.1 72.39,82.68 71.75,83.31 U11.9
N$48
  Top 0.406: U12.5 94.74,57.53 94.23,57.02 R27.2
N$49
  Top 0.635: R21.2 R20.1 94.23,64.39 93.6,63.75 84.96,63.75 84.2,62.99 84.2,54.48 84.71,53.98 90.93,53.98 U12.1
N$50
  Top 0.635: R20.2 74.55,66.29 73.91,66.93 73.91,81.03 73.28,81.66 66.04,81.66 65.41,82.3 U11.14
N$51
  Top 0.635: R28.2 R17.1
N$52
  Bottom 1.27: J1.8 101.6,16.51 R18.2
N$53
  Top 0.635: R24.2 R23.1 C24.1
N$54
  Top 0.635: R24.1 R22.1 88.27,13.85 D18.C
N$55  (via drill 0.7 pad 0.61)
  Top 0.381: 80.39,17.02 68.96,17.02 63.88,22.1 63.88,30.48 v63.63,30.61 | v50.67,30.86 51.69,31.88 52.8,31.88 U10.22
  Top 0.635: 80.39,17.02 R23.2 78.11,17.14 78.11,23.62 78.74,24.26 I-MAINS.MP
  Bottom 0.381: v50.67,30.86 63.37,30.86 v63.63,30.61
N$56
  Bottom 1.27: J1.7 99.06,15.24 93.98,20.32 R17.2
N$59  (via drill 0.5 pad 0.61)
  Top 0.254: U10.17 52.96,35.94 52.96,42.29 v53.09,42.29
  Bottom 0.254: J2.7 67.31,9.78 67.94,10.41 74.3,10.41 74.42,10.54 74.42,42.04 74.17,42.29 v53.09,42.29 52.96,42.29
N$60
  Top 0.254: J3.8 53.98,5.71 52.83,5.71 52.2,5.08 52.2,2.54 53.34,1.4 71.63,1.4 73.53,3.3 73.53,11.18 62.61,22.1 62.61,30.61 62.23,30.99 61.47,30.99 U10.2
N$61
  Top 0.254: J3.7 55.24,1.91 69.6,1.91 70.99,3.3 70.99,12.83 61.47,22.35 61.47,30.1 U10.1
N$62
  Top 0.254: J3.6 50.8,15.24 59.94,24.38 59.94,28.7 U10.32
N$63
  Top 0.254: J3.5 48.26,13.46 59.05,24.26 59.05,28.7 U10.31
N$64
  Top 0.254: J3.4 43.81,1.91 37.59,1.91 36.96,2.54 36.96,5.08 41.02,9.14 41.02,14.48 53.21,26.67 53.21,29.08 53.98,29.84 56.39,29.84 56.64,29.59 56.64,28.83 U10.28
N$65
  Top 0.254: J3.3 42.93,3.81 42.55,4.19 42.55,13.59 43.18,14.22 55.88,27.05 55.88,28.7 U10.27
N$66
  Top 0.254: J3.2 42.04,5.21 42.04,13.97 55.12,27.05 55.12,28.7 U10.26
N$67
  Top 0.254: J3.1 41.53,7.24 41.53,14.22 54.23,26.92 54.23,28.7 U10.25
N$68
  Top 0.254: PC0.MP 39.5,21.46 46.48,21.46 52.2,27.18 52.2,28.96 51.56,29.59 51.56,30.35 52.2,30.99 52.83,30.99 U10.23
N$69
  Top 0.254: 52.96,30.23 52.7,30.23 52.7,26.92 42.29,16.51 PC1.MP | 52.96,30.23 53.34,30.23 | 52.96,30.23 U10.24

### Text on the board
tDocu: CC-BY-SA | ReactorForge | MKII V1.1